# Altium schematic sheet PDM.SchDoc
size A
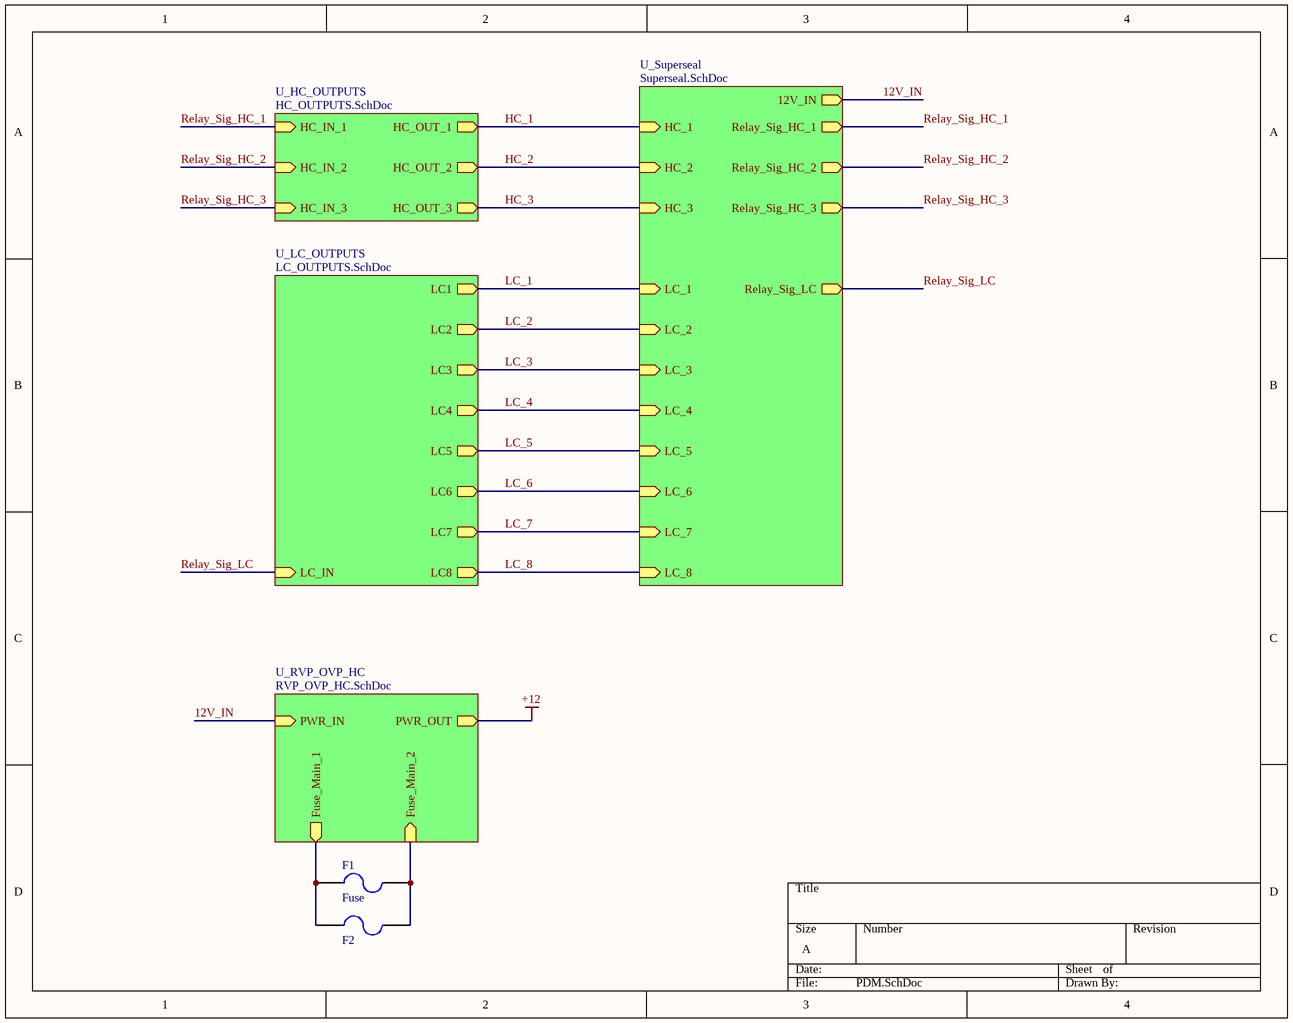
[diagram p0: PDM.SchDoc]

## Parts
F1  Fuse  [3568-MiniFuseHolder]
F2  Fuse  [3568-MiniFuseHolder]  (value not drawn)

## Sub-sheets
U_HC_OUTPUTS = HC_OUTPUTS.SchDoc: HC_IN_1 (in), HC_OUT_1 (out), HC_IN_2 (in), HC_OUT_2 (out), HC_IN_3 (in), HC_OUT_3 (out)
U_LC_OUTPUTS = LC_OUTPUTS.SchDoc: LC8 (out), LC1 (out), LC2 (out), LC3 (out), LC4 (out), LC5 (out), LC6 (out), LC7 (out), LC_IN (in)
U_RVP_OVP_HC = RVP_OVP_HC.SchDoc: PWR_IN (in), PWR_OUT (out), Fuse_Main_1 (out), Fuse_Main_2 (in)
U_Superseal = Superseal.SchDoc: 12V_IN (out), Relay_Sig_LC (out), Relay_Sig_HC_1 (out), Relay_Sig_HC_2 (out), HC_1 (in), HC_2 (in), LC_1 (in), LC_2 (in), LC_3 (in), LC_4 (in), LC_5 (in), LC_6 (in), LC_7 (in), LC_8 (in), Relay_Sig_HC_3 (out), HC_3 (in)

## Nets
+12: sheet U_RVP_OVP_HC/PWR_OUT
12V_IN: sheet U_RVP_OVP_HC/PWR_IN, sheet U_Superseal/12V_IN
HC_1: sheet U_HC_OUTPUTS/HC_OUT_1, sheet U_Superseal/HC_1
HC_2: sheet U_HC_OUTPUTS/HC_OUT_2, sheet U_Superseal/HC_2
HC_3: sheet U_HC_OUTPUTS/HC_OUT_3, sheet U_Superseal/HC_3
LC_1: sheet U_LC_OUTPUTS/LC1, sheet U_Superseal/LC_1
LC_2: sheet U_LC_OUTPUTS/LC2, sheet U_Superseal/LC_2
LC_3: sheet U_LC_OUTPUTS/LC3, sheet U_Superseal/LC_3
LC_4: sheet U_LC_OUTPUTS/LC4, sheet U_Superseal/LC_4
LC_5: sheet U_LC_OUTPUTS/LC5, sheet U_Superseal/LC_5
LC_6: sheet U_LC_OUTPUTS/LC6, sheet U_Superseal/LC_6
LC_7: sheet U_LC_OUTPUTS/LC7, sheet U_Superseal/LC_7
LC_8: sheet U_LC_OUTPUTS/LC8, sheet U_Superseal/LC_8
Relay_Sig_HC_1: sheet U_HC_OUTPUTS/HC_IN_1, sheet U_Superseal/Relay_Sig_HC_1
Relay_Sig_HC_2: sheet U_HC_OUTPUTS/HC_IN_2, sheet U_Superseal/Relay_Sig_HC_2
Relay_Sig_HC_3: sheet U_HC_OUTPUTS/HC_IN_3, sheet U_Superseal/Relay_Sig_HC_3
Relay_Sig_LC: sheet U_LC_OUTPUTS/LC_IN, sheet U_Superseal/Relay_Sig_LC
NetF1_1: F1.1 F2.1 ; sheet U_RVP_OVP_HC/Fuse_Main_1
NetF1_2: F1.2 F2.2 ; sheet U_RVP_OVP_HC/Fuse_Main_2

## Library data of the parts
F1 F2 = 3: Manufacturer_id: 1; idFuse: 3; Name: 3568 Mini Fuse Holder; Drawer_id: 1
  F2: Link: https://www.digikey.com/product-detail/en/keystone-electronics/3568/36-3568-ND/2137306